# Altium schematic sheet MECHANICAL.SchDoc: {Наименование}
size 420 x 297 mm; ApprovedBy: {Утвердил}; CheckedBy: {Проверил}; DrawnBy: {Разраб.}; SheetNumber: 6; Scale: {Мш.}; PageSetup: Record=PageOptions|CenterHorizontal=False|CenterVertical=False|PrintScale=0.95|XCorrection=0.00|YCorrection=0.00|PrintKind=1|BorderSize=5000000|LeftOffset=0|BottomOffset=0|Orientation=1|PaperLength=1000|PaperWidth=1000|Scale=100|PaperSource=15|PrintQuality=600|MediaType=1|DitherType=10|PaperKind=A4|PrintScaleMode=1; ProcessInspection: {Т.контр.}; Mass: {М.}; NormInspection: {Н.контр.}; Letter1Column: {}; Letter2Column: {}; Letter3Column: {}; DocumentType: {Документ}; Rule: PcbType=ProtelPcb
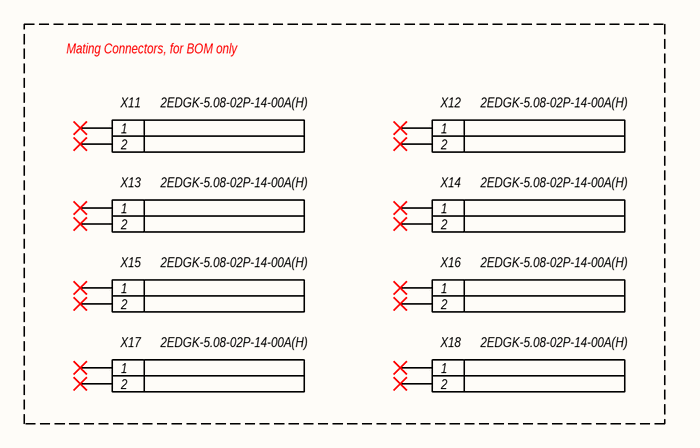
[diagram p0: MECHANICAL.SchDoc]

## Parts
X11  2EDGK-5.08-02P-14-00A(H)  [2EDGK-5.08-02P-14-00A(H)]
X12  2EDGK-5.08-02P-14-00A(H)  [2EDGK-5.08-02P-14-00A(H)]
X13  2EDGK-5.08-02P-14-00A(H)  [2EDGK-5.08-02P-14-00A(H)]
X14  2EDGK-5.08-02P-14-00A(H)  [2EDGK-5.08-02P-14-00A(H)]
X15  2EDGK-5.08-02P-14-00A(H)  [2EDGK-5.08-02P-14-00A(H)]
X16  2EDGK-5.08-02P-14-00A(H)  [2EDGK-5.08-02P-14-00A(H)]
X17  2EDGK-5.08-02P-14-00A(H)  [2EDGK-5.08-02P-14-00A(H)]
X18  2EDGK-5.08-02P-14-00A(H)  [2EDGK-5.08-02P-14-00A(H)]

## Blocks framed on the sheet
Mating Connectors, for BOM only: X11-X18

## Nets

Not connected (* = marked no-connect by the designer): X11 1* 2*; X12 1* 2*; X13 1* 2*; X14 1* 2*; X15 1* 2*; X16 1* 2*; X17 1* 2*; X18 1* 2*

## Notes on the sheet
- Перв. примен.
- Справ. №
- Подп. и дата
- Инв. № дубл.
- Взам. инв. №
- Изм.
- Лист
- № докум.
- Подп.
- Дата
- Т.контр.
- Пров.
- Разраб.
- Лит.
- Листов
- Инв. № подл.
- Н.контр.
- Утв.
- Копировал
- Формат А3

## Library data of the parts
X11-X18 = 2EDGK-5.08-02P-14-00A(H): Разъем, 2 контакта; Тип разъема: Pluggable terminal block; Количество контактов: 2; Шаг контактов: 5.08mm; Ток: 20A; Напряжение: 320V; Производитель: Degson Electronics; Описание: Pluggable terminal block; 5.08m; ways: 2; plug; female; Температурный диапазон: -40°C ~ 105°C; Вид монтажа: Through Hole; Артикул: 2EDGK-5.08-02P-14-00A(H); Строка для документации: https://static.chipdip.ru/lib/045/DOC013045856.pdf; Тип элемента: Разъем